# EAGLE design Display_Board_v4 (EAGLE 8.7.0)

## Sheet 1 of 3: Micro and CAN
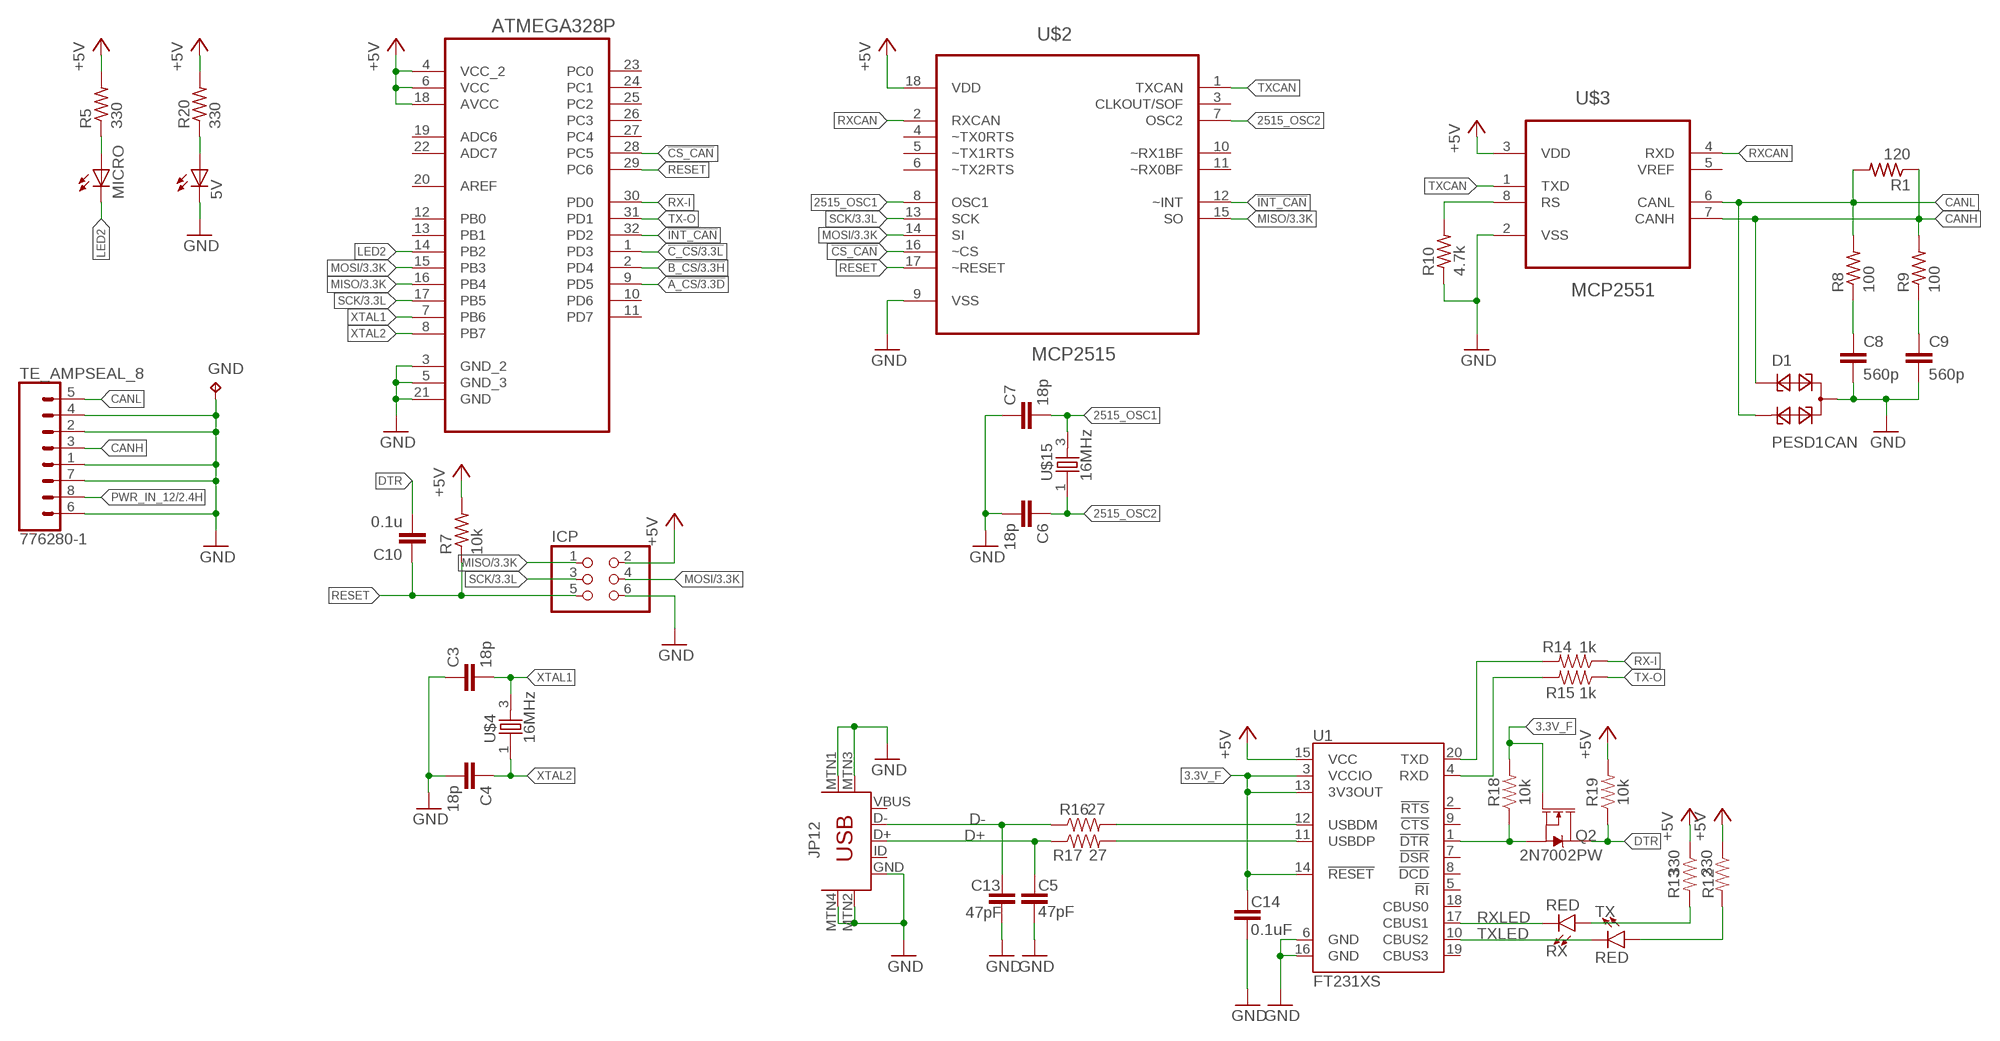
[diagram p0: schematic, sheet 1]

### Parts
5V  LEDCHIP-LED0805  [CHIP-LED0805]
ATMEGA328P  ATMEGA328P-AU  [QFP80P900X900X120-32N]
C3  18p  C-EUC0805K  [C0805K]
C4  18p  C-EUC0805K  [C0805K]
C5  47pF  47PF-0603-50V-5%  [0603]
C6  18p  C-EUC0805K  [C0805K]
C7  18p  C-EUC0805K  [C0805K]
C8  560p  C-EUC0805K  [C0805K]
C9  560p  C-EUC0805K  [C0805K]
C10  0.1u  C-EUC0805K  [C0805K]
C13  47pF  47PF-0603-50V-5%  [0603]
C14  0.1uF  0.1UF-0603-25V-(+80/-20%)  [0603]
D1  PESD1CAN  [SOT23]
GND  TPTP12SQ  [TP12SQ]
ICP  PINHD-2X3  [2X03]
JP12  USB-MINIB-5PIN  [USB-MINIB]
MICRO  LEDCHIP-LED0805  [CHIP-LED0805]
Q2  2N7002PW  MOSFET-NCH-2N7002PW  [SOT323]
R1  120  R-US_R0805  [R0805]
R5  330  R-US_R0805  [R0805]
R7  10k  R-US_R0805  [R0805]
R8  100  R-US_R0805  [R0805]
R9  100  R-US_R0805  [R0805]
R10  4.7k  R-US_R0805  [R0805]
R12  330  1KOHM-0603-1/10W-1%  [0603]
R13  330  1KOHM-0603-1/10W-1%  [0603]
R14  1k  1KOHM-0603-1/10W-1%  [0603]
R15  1k  1KOHM-0603-1/10W-1%  [0603]
R16  27  27OHM-0603-1/10W-1%  [0603]
R17  27  27OHM-0603-1/10W-1%  [0603]
R18  10k  10KOHM-0603-1/10W-1%  [0603]
R19  10k  10KOHM-0603-1/10W-1%  [0603]
R20  330  R-US_R0805  [R0805]
RX  RED  LED1206  [LED-1206]
TE_AMPSEAL_8  776280-1  [776280-1]
TX  RED  LED1206  [LED-1206]
U1  FT231XS  [SSOP20_L]
U$2  MCP2515  MCP2515-I/SO  [SOIC127P1034X264-18N]
U$3  MCP2551  MCP2551-I/SN  [SOIC127P600X175-8N]
U$4  16MHz  406CYRYSTAL  [CTS406]
U$15  16MHz  406CYRYSTAL  [CTS406]

### Nets
3.3V_F: C14.1 Q2.1(G) R18.2 U1.3(VCCIO) U1.13(3V3OUT) U1.14(!RESET)
2515_OSC1: C7.2 U$2.8(OSC1) U$15.3
2515_OSC2: C6.1 U$2.7(OSC2) U$15.1
!A_CS: ATMEGA328P.9(PD5) ; also sheet 3
!B_CS: ATMEGA328P.2(PD4) ; also sheet 3
!C_CS: ATMEGA328P.1(PD3) ; also sheet 3
!CS_CAN: ATMEGA328P.28(PC5) U$2.16(~CS)
!INT_CAN: ATMEGA328P.32(PD2) U$2.12(~INT)
+5V: ATMEGA328P.4(VCC_2) ATMEGA328P.6(VCC) ATMEGA328P.18(AVCC) ICP.2 R5.2 R7.2 R12.1 R13.1 R19.2 R20.2 U1.15(VCC) U$2.18(VDD) U$3.3(VDD) ; also sheet 2,3
CANH: D1.1 R1.1 R9.2 TE_AMPSEAL_8.3 U$3.7(CANH)
CANL: D1.2 R1.2 R8.2 TE_AMPSEAL_8.5 U$3.6(CANL)
D+: C5.1 JP12.D+ R17.1
D-: C13.1 JP12.D- R16.1
DTR: C10.2 Q2.3(D) R19.1
FTDI_DTR: Q2.2(S) R18.1 U1.1(!DTR)
GND: 5V.C ATMEGA328P.3(GND_2) ATMEGA328P.5(GND_3) ATMEGA328P.21(GND) C3.1 C4.2 C5.2 C6.2 C7.1 C8.2 C9.2 C13.2 C14.2 D1.3 GND.TP ICP.6 JP12.GND JP12.MTN1(MTN2) JP12.MTN2(MTN3) JP12.MTN3(MTN1) JP12.MTN4 R10.1 TE_AMPSEAL_8.1 TE_AMPSEAL_8.2 TE_AMPSEAL_8.4 TE_AMPSEAL_8.6 TE_AMPSEAL_8.7 U1.6(GND) U1.16(GND) U$2.9(VSS) U$3.2(VSS) ; also sheet 2,3
LED2: ATMEGA328P.14(PB2) MICRO.C
MISO: ATMEGA328P.16(PB4) ICP.1 U$2.15(SO) ; also sheet 3
MOSI: ATMEGA328P.15(PB3) ICP.4 U$2.14(SI) ; also sheet 3
N$1: R12.2 TX.A
N$2: R16.2 U1.12(USBDM)
N$3: MICRO.A R5.1
N$4: R17.2 U1.11(USBDP)
N$5: R10.2 U$3.8(RS)
N$6: C8.1 R8.1
N$7: C9.1 R9.1
N$10: R13.2 RX.A
N$12: 5V.A R20.1
PWR_IN_12: TE_AMPSEAL_8.8 ; also sheet 2
RESET: ATMEGA328P.29(PC6) C10.1 ICP.5 R7.1 U$2.17(~RESET)
RX-I: ATMEGA328P.30(PD0) R14.1
RXCAN: U$2.2(RXCAN) U$3.4(RXD)
RXD1: R15.2 U1.4(RXD)
RXLED: RX.C U1.17(CBUS1)
SCK: ATMEGA328P.17(PB5) ICP.3 U$2.13(SCK) ; also sheet 3
TX-O: ATMEGA328P.31(PD1) R15.1
TXCAN: U$2.1(TXCAN) U$3.1(TXD)
TXD1: R14.2 U1.20(TXD)
TXLED: TX.C U1.10(CBUS2)
XTAL1: ATMEGA328P.7(PB6) C3.2 U$4.3
XTAL2: ATMEGA328P.8(PB7) C4.1 U$4.1
Unconnected: ATMEGA328P.10(PD6) ATMEGA328P.11(PD7) ATMEGA328P.12(PB0) ATMEGA328P.13(PB1) ATMEGA328P.19(ADC6) ATMEGA328P.20(AREF) ATMEGA328P.22(ADC7) ATMEGA328P.23(PC0) ATMEGA328P.24(PC1) ATMEGA328P.25(PC2) ATMEGA328P.26(PC3) ATMEGA328P.27(PC4) JP12.ID JP12.VBUS U1.2(!RTS) U1.5(!RI) U1.7(!DSR) U1.8(!DCD) U1.9(!CTS) U1.18(CBUS0) U1.19(CBUS3) U$2.3(CLKOUT/SOF) U$2.4(~TX0RTS) U$2.5(~TX1RTS) U$2.6(~TX2RTS) U$2.10(~RX1BF) U$2.11(~RX0BF) U$3.5(VREF)

## Sheet 2 of 3: Power
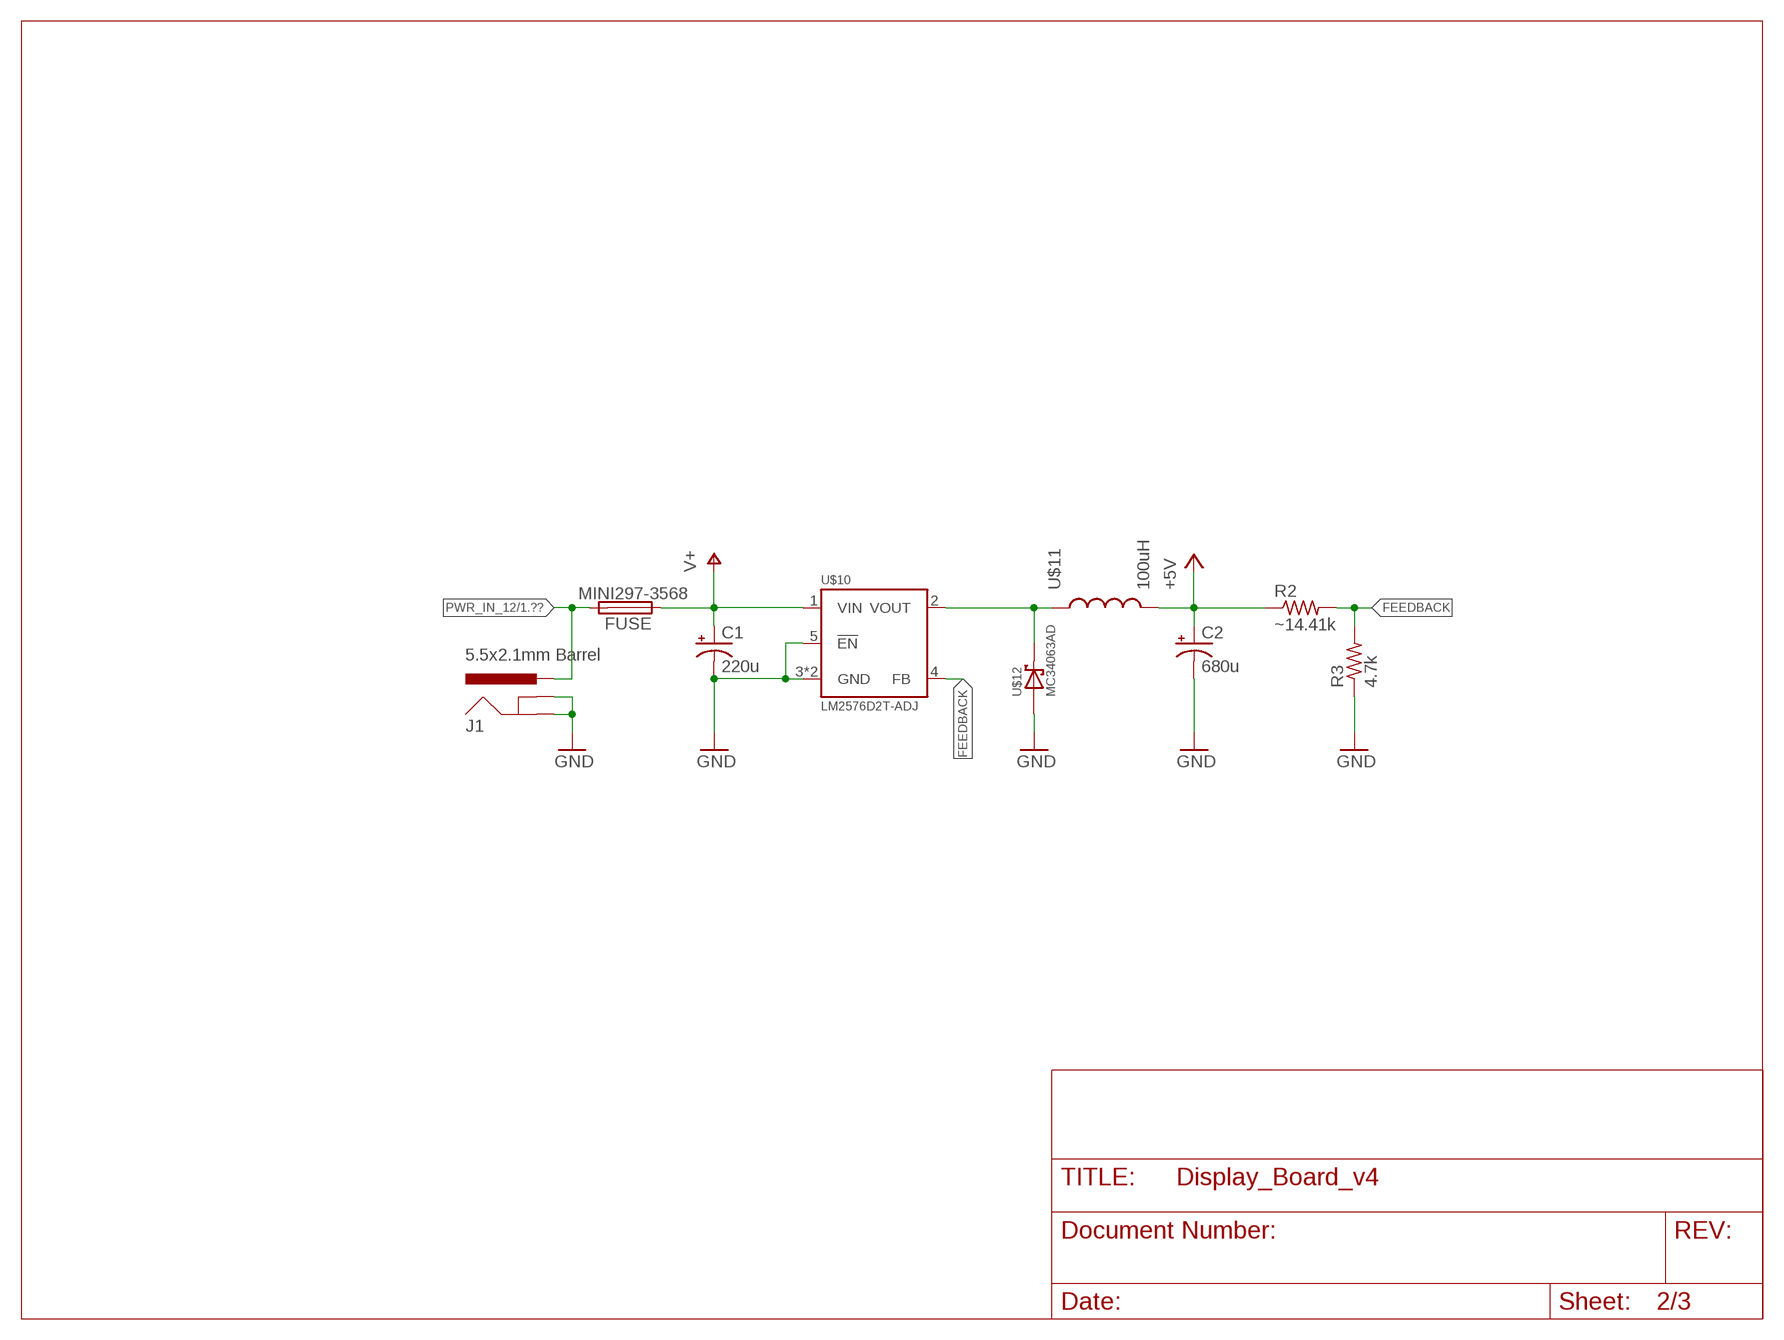
[diagram p1: schematic, sheet 2]

### Parts
C1  220u  CPOL-USUD-6,3X7,7  [UD-6,3X7,7_NICHICON]
C2  680u  CPOL-USUD-6,3X7,7  [UD-6,3X7,7_NICHICON]
FUSE  MINI297-3568  [3568]
J1  5.5x2.1mm Barrel  POWER_JACKSMD  [POWER_JACK_SMD]
R2  ~14.41k  R-US_R0603  [R0603]
R3  4.7k  R-US_R0603  [R0603]
U$10  LM2576D2T-ADJ  [TO263-5]
U$11  100uH  INDUCTOR  [12MM_12MM_INDUCTOR]
U$12  MC34063AD  [SMC]

### Nets
+5V: C2.+ R2.1 U$11.P$2 ; also sheet 1,3
FEEDBACK: R2.2 R3.2 U$10.4(FB)
GND: C1.- C2.- J1.GND(GNDBREAK) J1.P$4(GND) R3.1 U$10.3(GND) U$10.5(!EN) U$10.6(GND) U$12.A ; also sheet 1,3
N$8: U$10.2(VOUT) U$11.P$1 U$12.C
PWR_IN_12: FUSE.P$2 FUSE.P$3 J1.VIN0(PWR) ; also sheet 1
V+: C1.+ FUSE.P$1 FUSE.P$4 U$10.1(VIN)

## Sheet 3 of 3: Displays
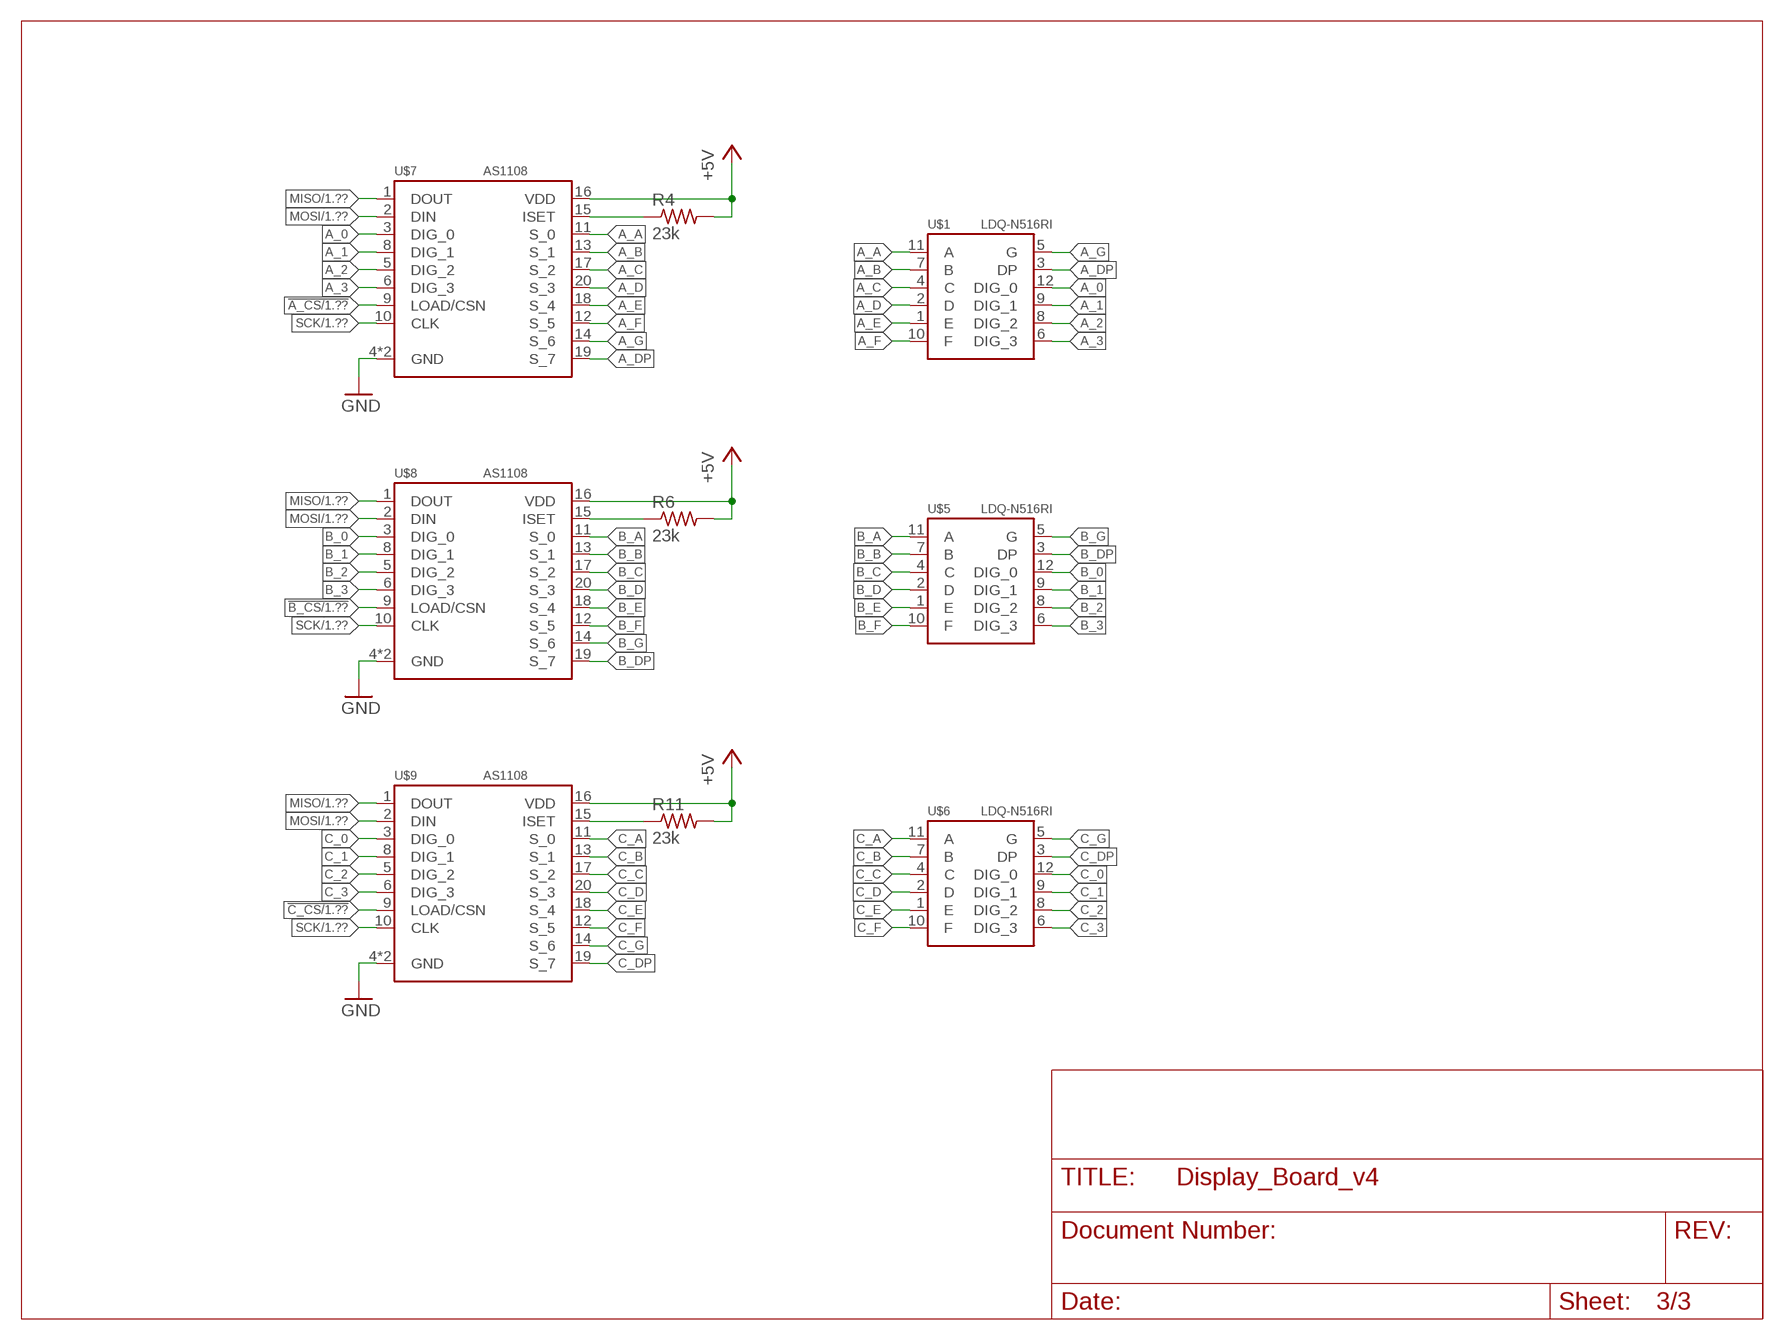
[diagram p2: schematic, sheet 3]

### Parts
R4  23k  R-US_R0603  [R0603]
R6  23k  R-US_R0603  [R0603]
R11  23k  R-US_R0603  [R0603]
U$1  LDQ-N516RI  [4_DIGIT_7_SEGMENT_DISPLAY_0.56"]
U$5  LDQ-N516RI  [4_DIGIT_7_SEGMENT_DISPLAY_0.56"]
U$6  LDQ-N516RI  [4_DIGIT_7_SEGMENT_DISPLAY_0.56"]
U$7  AS1108  [SO20L]
U$8  AS1108  [SO20L]
U$9  AS1108  [SO20L]

### Nets
!A_CS: U$7.9(LOAD/CSN) ; also sheet 1
!B_CS: U$8.9(LOAD/CSN) ; also sheet 1
!C_CS: U$9.9(LOAD/CSN) ; also sheet 1
+5V: R4.2 R6.2 R11.2 U$7.16(VDD) U$8.16(VDD) U$9.16(VDD) ; also sheet 1,2
A_0: U$1.12(DIG_0) U$7.3(DIG_0)
A_1: U$1.9(DIG_1) U$7.8(DIG_1)
A_2: U$1.8(DIG_2) U$7.5(DIG_2)
A_3: U$1.6(DIG_3) U$7.6(DIG_3)
A_A: U$1.11(A) U$7.11(S_0)
A_B: U$1.7(B) U$7.13(S_1)
A_C: U$1.4(C) U$7.17(S_2)
A_D: U$1.2(D) U$7.20(S_3)
A_DP: U$1.3(DP) U$7.19(S_7)
A_E: U$1.1(E) U$7.18(S_4)
A_F: U$1.10(F) U$7.12(S_5)
A_G: U$1.5(G) U$7.14(S_6)
B_0: U$5.12(DIG_0) U$8.3(DIG_0)
B_1: U$5.9(DIG_1) U$8.8(DIG_1)
B_2: U$5.8(DIG_2) U$8.5(DIG_2)
B_3: U$5.6(DIG_3) U$8.6(DIG_3)
B_A: U$5.11(A) U$8.11(S_0)
B_B: U$5.7(B) U$8.13(S_1)
B_C: U$5.4(C) U$8.17(S_2)
B_D: U$5.2(D) U$8.20(S_3)
B_DP: U$5.3(DP) U$8.19(S_7)
B_E: U$5.1(E) U$8.18(S_4)
B_F: U$5.10(F) U$8.12(S_5)
B_G: U$5.5(G) U$8.14(S_6)
C_0: U$6.12(DIG_0) U$9.3(DIG_0)
C_1: U$6.9(DIG_1) U$9.8(DIG_1)
C_2: U$6.8(DIG_2) U$9.5(DIG_2)
C_3: U$6.6(DIG_3) U$9.6(DIG_3)
C_A: U$6.11(A) U$9.11(S_0)
C_B: U$6.7(B) U$9.13(S_1)
C_C: U$6.4(C) U$9.17(S_2)
C_D: U$6.2(D) U$9.20(S_3)
C_DP: U$6.3(DP) U$9.19(S_7)
C_E: U$6.1(E) U$9.18(S_4)
C_F: U$6.10(F) U$9.12(S_5)
C_G: U$6.5(G) U$9.14(S_6)
GND: U$7.4(GND) U$7.7(GND) U$8.4(GND) U$8.7(GND) U$9.4(GND) U$9.7(GND) ; also sheet 1,2
MISO: U$7.1(DOUT) U$8.1(DOUT) U$9.1(DOUT) ; also sheet 1
MOSI: U$7.2(DIN) U$8.2(DIN) U$9.2(DIN) ; also sheet 1
N$15: R6.1 U$8.15(ISET)
N$19: R11.1 U$9.15(ISET)
N$22: R4.1 U$7.15(ISET)
SCK: U$7.10(CLK) U$8.10(CLK) U$9.10(CLK) ; also sheet 1

## Library data of the parts
5V MICRO = led:LED: LED OSRAM: - CHIPLED LG R971, LG N971, LY N971, LG Q971, LY Q971, LO R971, LY R971 LH N974, LH R974 LS Q976, LO Q976, LY Q976 LO Q996 - Hyper CHIPLED LW Q18S LB Q993, LB Q99A, LB R99A - SideLED LS A670, LO A670, LY A670, LG A670, LP A670 LB A673, LV A673, LT A673, LW A673 LH A674 LY A675 LS A676, LA A676, LO A676, LY A676, LW A676 LS A679, LY A679, LG A679 - Hyper Micro SIDELED® LS Y876, LA Y876, LO Y876, LY Y876 LT Y87S - SmartLED LW L88C, LW L88S LB L89C, LB L89S, LG L890 LS L89K, LO L89K, LY L89K LS L896, LA L896, LO L896, LY L896 - TOPLED LS T670, LO T670, LY T670, LG T670, LP T670 LSG T670, LSP T670, LSY T670, LOP T670, LYG T670 LG T671, LOG T671, LSG T671 LB T673, LV T673, LT T673, LW T673 LH T674 LS T676, LA T676, LO T676, LY T676, LB T676, LH T676, LSB T676, LW T676 LB T67C, LV T67C, LT T67C, LS T67K, LO T67K, LY T67K, LW E67C LS E67B, LA E67B, LO E67B, LY E67B, LB E67C, LV E67C, LT E67C LW T67C LS T679, LY T679, LG T679 LS T770, LO T770, LY T770, LG T770, LP T770 LB T773, LV T773, LT T773, LW T773 LH T774 LS E675, LA E675, LY E675, LS T675 LS T776, LA T776, LO T776, LY T776, LB T776 LHGB T686 LT T68C, LB T68C - Hyper Mini TOPLED® LB M676 - Mini TOPLED Santana® LG M470 LS M47K, LO M47K, LY M47K Source: http://www.osram.convergy.de LUXEON: - LUMILED® LXK2-PW12-R00, LXK2-PW12-S00, LXK2-PW14-U00, LXK2-PW14-V00 LXK2-PM12-R00, LXK2-PM12-S00, LXK2-PM14-U00 LXK2-PE12-Q00, LXK2-PE12-R00, LXK2-PE12-S00, LXK2-PE14-T00, LXK2-PE14-U00 LXK2-PB12-K00, LXK2-PB12-L00, LXK2-PB12-M00, LXK2-PB14-N00, LXK2-PB14-P00, LXK2-PB14-Q00 LXK2-PR12-L00, LXK2-PR12-M00, LXK2-PR14-Q00, LXK2-PR14-R00 LXK2-PD12-Q00, LXK2-PD12-R00, LXK2-PD12-S00 LXK2-PH12-R00, LXK2-PH12-S00 LXK2-PL12-P00, LXK2-PL12-Q00, LXK2-PL12-R00 Source: www.luxeon.com KINGBRIGHT: KA-3528ASYC Source: www.kingbright.com
ATMEGA328P = Atmel_By_element14_Batch_1-00:ATMEGA328P-AU: 8-bit Microcontroller with In-System Programmable Flash; MPN: ATMEGA328P-AU; OC_FARNELL: 1715486; OC_NEWARK: 14R4631; PACKAGE: TQFP-32; SUPPLIER: Atmel
C1 C2 = rcl:CPOL-US: POLARIZED CAPACITOR, American symbol; SPICEPREFIX: C
C3 C4 C6 C7 C10 = resistor:C-EU: CAPACITOR, European symbol
C5 C13 = SparkFun-Capacitors:47PF: 47pF ceramic capacitors A capacitor is a passive two-terminal electrical component used to store electrical energy temporarily in an electric field.; PROD_ID: CAP-08913
C8 C9 = rcl:C-EU: CAPACITOR, European symbol
C14 = SparkFun-Capacitors:0.1UF: 0.1µF ceramic capacitors A capacitor is a passive two-terminal electrical component used to store electrical energy temporarily in an electric field.; PROD_ID: CAP-00810
D1 = diode:PESD1CAN: CAN bus ESD protection diode Source: http://www.nxp.com/documents/data_sheet/PESD1CAN.pdf
FUSE = Fuse:MINI297-3568
GND = testpad:TP: Test pad
ICP = pinhead:PINHD-2X3: PIN HEADER
J1 = SparkFun-Connectors:POWER_JACK: Power Jack This is the standard 5.5mm barrel jack for power. The PTH is the most common, proven, reliable, footprint. The Slot footprint only works if the mill layer is transmitted to the PCB fab house so be warned. Mating wall wart : TOL-00298 (and others); PROD_ID: CONN-08106; SF_ID: PRT-12748
JP12 = SparkFun-Connectors:USB-MINIB: Mini-USB "B" connector with 5th pin broken out. Created new symbol breaking out 5th "ID" pin in mini/micro USB connector spec. See: http://en.wikipedia.org/wiki/Mini_usb#Cables. Uses same footprint as 4-pin symbol. Also added pins to connect to mounting / shield pads if required (probably not generally needed as signals aren't shielded once they leave the connector).; PROD_ID: CONN-08193
Q2 = SparkFun-DiscreteSemi:MOSFET-NCH: N-channel MOSFETs Voltage controlled devices that allow control of high current outputs.; PROD_ID: TRANS-11151; VALUE: 310mA/60V/1.6Ω
R1 R7-R10 = rcl:R-US_: RESISTOR, American symbol
R2-R4 R6 R11 = rcl:R-US_: RESISTOR, American symbol; SPICEPREFIX: R
R5 R20 = resistor:R-US_: RESISTOR, American symbol
R12 R13 = SparkFun-Resistors:1KOHM: 1kΩ resistor A resistor is a passive two-terminal electrical component that implements electrical resistance as a circuit element. Resistors act to reduce current flow, and, at the same time, act to lower voltage levels within circuits.; PROD_ID: RES-07856; VALUE: 1k
R14 R15 = SparkFun-Resistors:1KOHM: 1kΩ resistor A resistor is a passive two-terminal electrical component that implements electrical resistance as a circuit element. Resistors act to reduce current flow, and, at the same time, act to lower voltage levels within circuits.; PROD_ID: RES-07856
R16 R17 = SparkFun-Resistors:27OHM: 27Ω resistor A resistor is a passive two-terminal electrical component that implements electrical resistance as a circuit element. Resistors act to reduce current flow, and, at the same time, act to lower voltage levels within circuits.; PROD_ID: RES-09334
R18 R19 = SparkFun-Resistors:10KOHM: 10kΩ resistor A resistor is a passive two-terminal electrical component that implements electrical resistance as a circuit element. Resistors act to reduce current flow, and, at the same time, act to lower voltage levels within circuits.; PROD_ID: RES-00824
RX = SparkFun-LED:LED: LED (Generic) Standard schematic elements and footprints for 5mm, 3mm, 1206, and 0603 sized LEDs. Generic LEDs with no color specified.; PROD_ID: DIO-09909
TE_AMPSEAL_8 = IFE_AMPSEAL_Conn:776280-1: AMPSEAL 8pin Connector Ampseal 8-pin connector Model: 776280-1
TX = SparkFun-LED:LED: LED (Generic) Standard schematic elements and footprints for 5mm, 3mm, 1206, and 0603 sized LEDs. Generic LEDs with no color specified.; PROD_ID: DIO-09912
U1 = SparkFun-IC-Comms:FT231X: FTDI FT231X Full Speed USB to Full-handshake UART This USB2.0 Full Speed IC offers a compact bridge to full handshake UART interfaces. The device is a UART, capable of operating up to 3MBaud, with low power consumption (8mA). The FT231X includes the complete FT-X series feature set and enables USB to be added into a system design quickly and easily over a UART interface.; PROD_ID: IC-11524
U$1 U$5 U$6 = Display_Custom:LDQ-N516RI: https://www.lumex.com/content/files/ProductAttachment/LDQ-N516RI.pdf
U$2 = Microchip_By_element14_Batch_1:MCP2515-I/SO: CAN Controller; MPN: MCP2515-I/SO; OC_FARNELL: 1292239; OC_NEWARK: 29H7136; PACKAGE: SOIC-18; SUPPLIER: Microchip
U$3 = Microchip_By_element14_Batch_1:MCP2551-I/SN: High-Speed CAN Transceiver; MPN: MCP2551-I/SN; OC_FARNELL: 9758569; OC_NEWARK: 69K7604; PACKAGE: SOIC-8; SUPPLIER: Microchip
U$4 U$15 = Display_Custom:406CYRYSTAL: Crystal Oscillator in 406 SMT Package https://www.ctscorp.com/wp-content/uploads/406.pdf
U$7-U$9 = Display_Custom:AS1108: AS1108 http://ams.com/documents/20143/36005/AS1108_DS000169_2-00.pdf
U$10 = Display_Custom:LM2576D2T-ADJ: LM2576D2T-ADJ Adjustable Buck Voltage Regulator http://www.onsemi.com/pub/Collateral/LM2576-D.PDF
U$11 = Display_Custom:INDUCTOR
U$12 = Display_Custom:MC34063AD: MC34063AD https://www.fairchildsemi.com/datasheets/MB/MBRS320.pdf 3 watt, 3A, fV 500mV, 20v rV

## Net classes
0 default: width 0.152 mm, drill 0.305 mm, clearance 0.152 mm

## Board
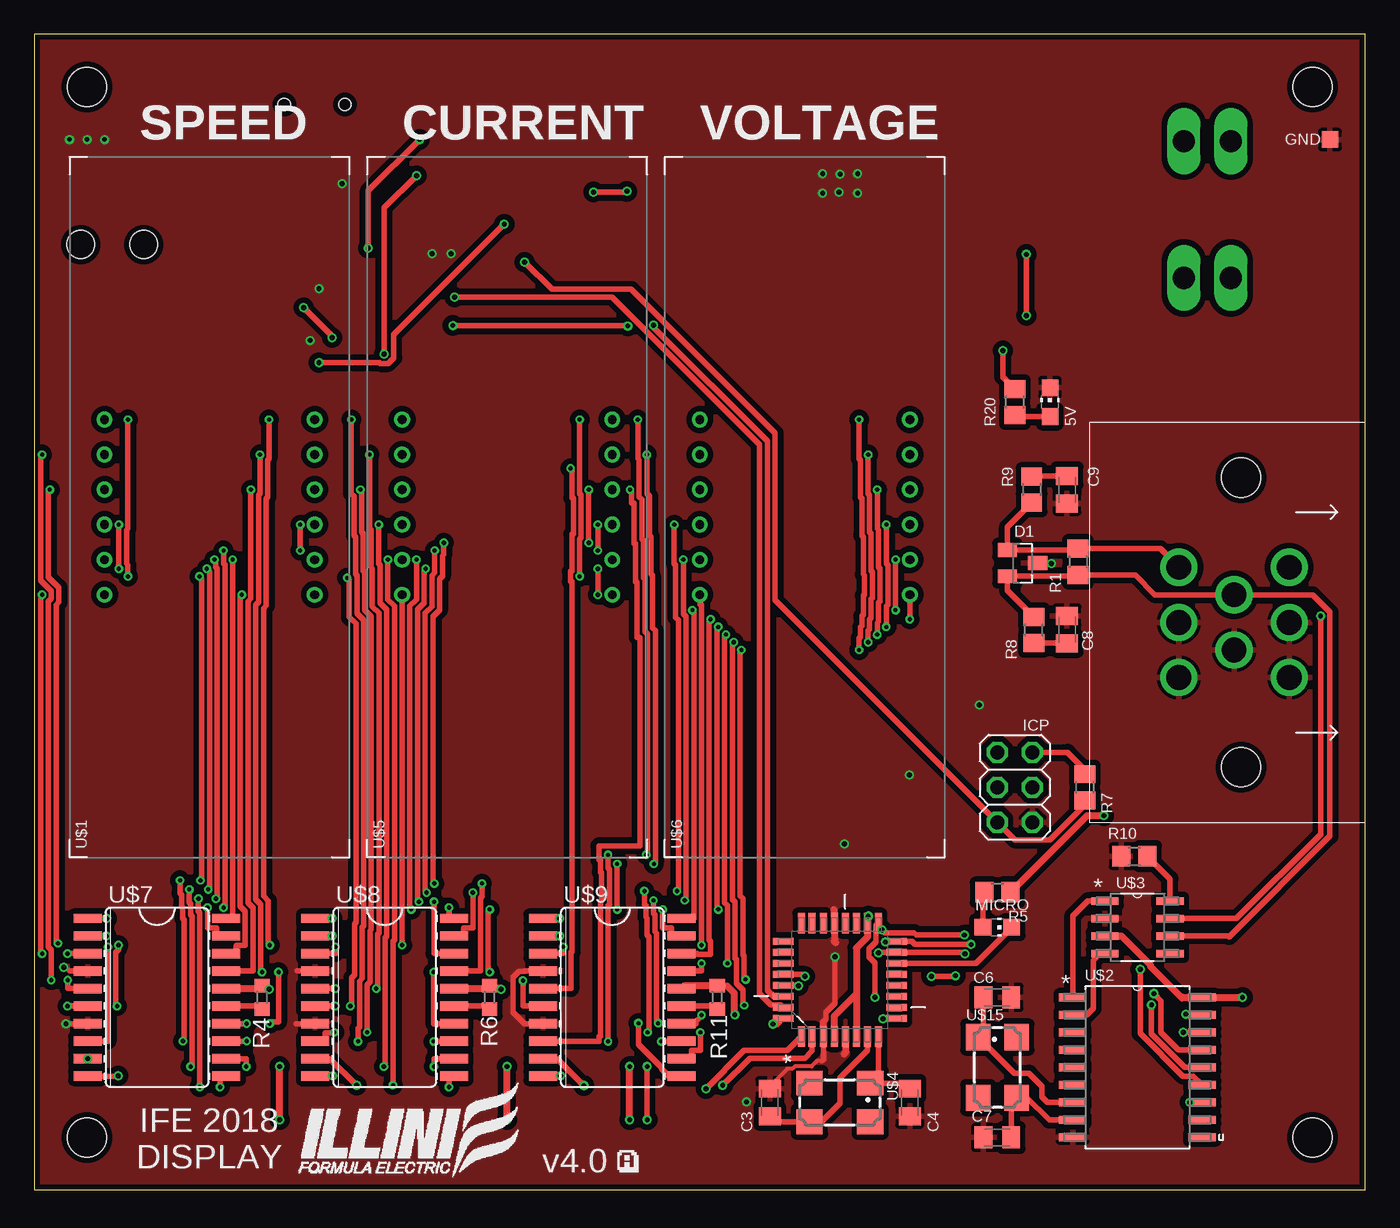
[diagram p3: board, top side]
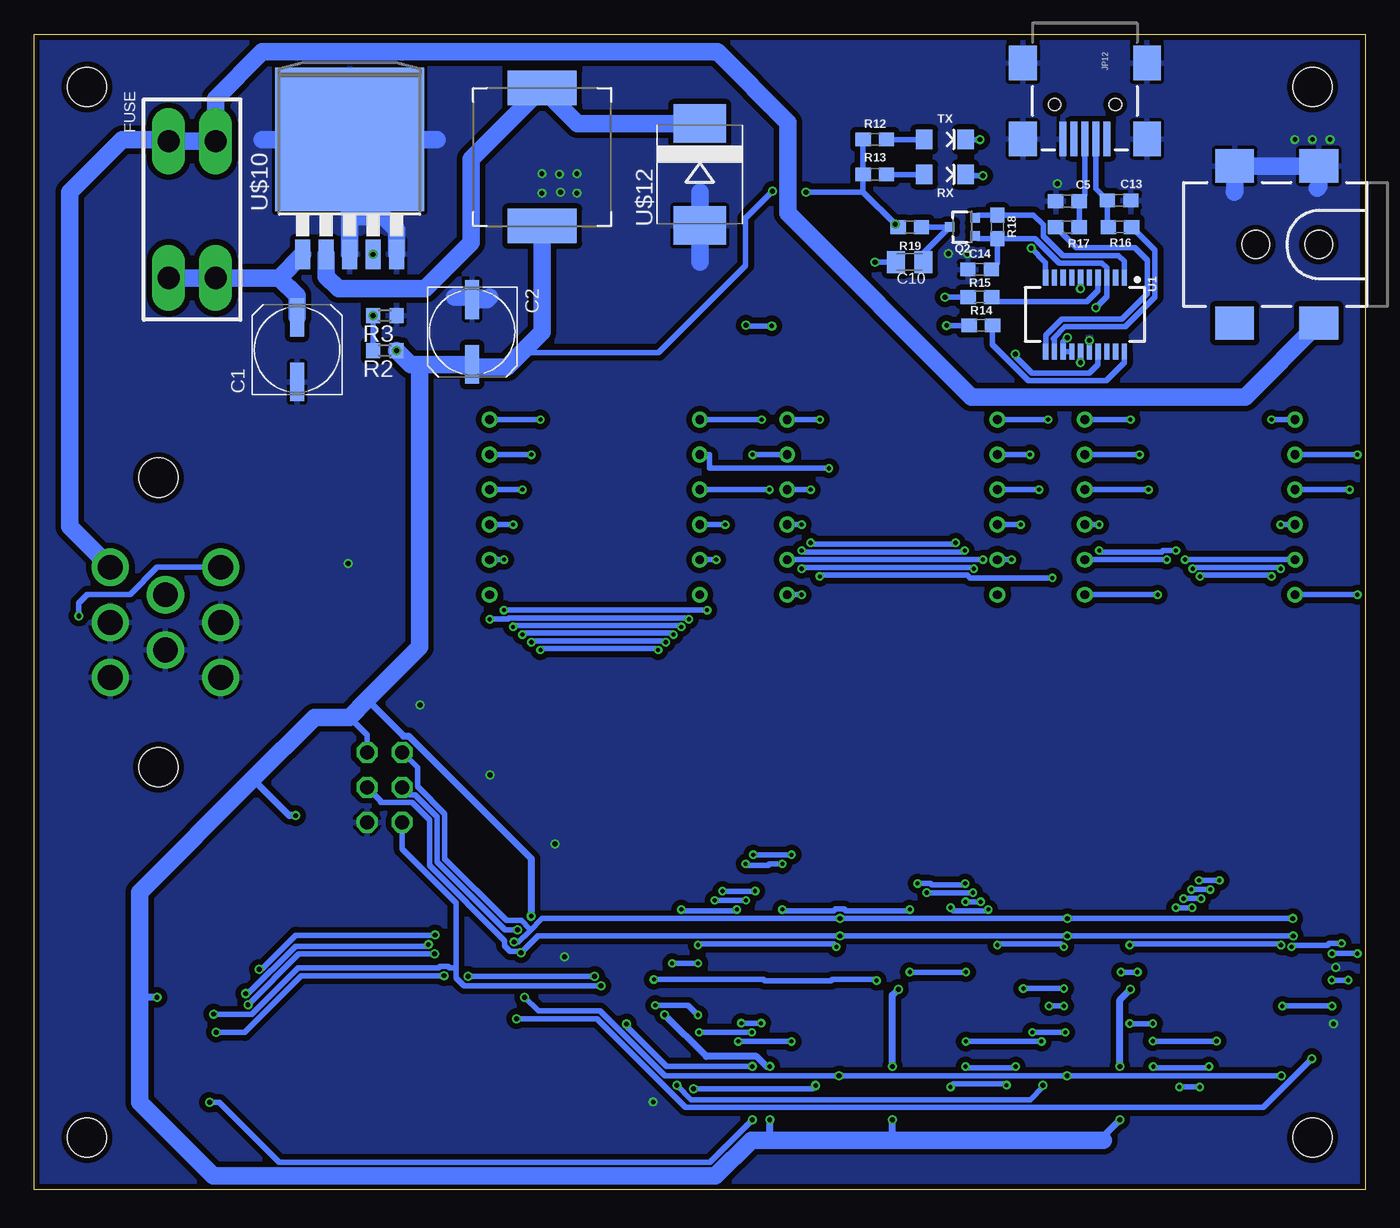
[diagram p4: board, bottom side, seen from below]

Size 96.52 x 83.82 mm. Coordinates in mm from the lower left corner, seen from the top.
Outline: 0,0 96.52,0 96.52,83.82 0,83.82 0,0
Copper layers (1*16): Top 0.035mm / dielectric 1.5mm / Bottom 0.035mm
Design rules "SeeedStudio_2layer_DRU_no_angle_20140221": minimum track width 6mil, minimum drill 12mil, track to track 6mil, track to pad 6mil, pad to pad 6mil, via to via 6mil, smd to smd 0mil, copper to edge 10mil, drill to drill 10mil, minimum pad ring 10mil, minimum via ring 6mil, stop-mask expansion 2mil, vias tented up to drill 100mil, thermal gap 10mil
Holes 2.84 mm at 3.81,3.81 92.71,3.81 92.71,80.01 3.81,80.01

### Footprints (pad centres in the part's own frame; a part is rotated, then mirrored left to right if it is on the bottom)
CHIP-LED0805 = smd 1.2 x 1.2: A 0,-1.05; C 0,1.05
QFP80P900X900X120-32N = smd 1.473 x 0.508: 1 -4.115,2.794; 2 -4.115,2.007; 3 -4.115,1.194; 4 -4.115,0.406; 5 -4.115,-0.406; 6 -4.115,-1.194; 7 -4.115,-2.007; 8 -4.115,-2.794; 17 4.115,-2.794; 18 4.115,-2.007; 19 4.115,-1.194; 20 4.115,-0.406; 21 4.115,0.406; 22 4.115,1.194; 23 4.115,2.007; 24 4.115,2.794 | smd 0.508 x 1.473: 9 -2.794,-4.115; 10 -2.007,-4.115; 11 -1.194,-4.115; 12 -0.406,-4.115; 13 0.406,-4.115; 14 1.194,-4.115; 15 2.007,-4.115; 16 2.794,-4.115; 25 2.794,4.115; 26 2.007,4.115; 27 1.194,4.115; 28 0.406,4.115; 29 -0.406,4.115; 30 -1.194,4.115; 31 -2.007,4.115; 32 -2.794,4.115
UD-6,3X7,7_NICHICON = smd 2.8 x 1: + 2.35,0; - -2.35,0
C0805K = smd 1.3 x 1.6: 1 -1,0; 2 1,0
0603 = smd 1.1 x 1: 1 -0.85,0; 2 0.85,0
SOT23 = smd 1 x 1.4: 1 -0.95,-1.1; 2 0.95,-1.1; 3 0,1.1
3568 = drill 1.6 long: P$1 -4.96,1.7; P$2 4.96,1.7; P$3 4.96,-1.7; P$4 -4.96,-1.7
TP12SQ = smd 1.2 x 1.2: TP 0,0
2X03 = drill 1.016 octagon: 1 -2.54,-1.27; 2 -2.54,1.27; 3 0,-1.27; 4 0,1.27; 5 2.54,-1.27; 6 2.54,1.27
POWER_JACK_SMD = smd 2.8 x 2.4: GND 0,-5.7; P$4 6.1,-5.7; VIN0 0,5.7; VIN1 6.1,5.7 | hole 2.032: 0,0; 4.572,0
USB-MINIB = smd 2.5 x 0.5: D+ 2.5,0; D- 2.5,0.8; GND 2.5,-1.6; ID 2.5,-0.8; VBUS 2.5,1.6 | smd 2.5 x 2: MTN1 -3,4.5; MTN2 2.5,4.5; MTN3 -3,-4.5; MTN4 2.5,-4.5 | hole 0.9: 0,2.2; 0,-2.2
SOT323 = smd 0.7 x 0.7: 1 -0.65,-0.925; 2 0.65,-0.925; 3 0,0.925
R0805 = smd 1.3 x 1.5: 1 -0.95,0; 2 0.95,0
R0603 = smd 1 x 1.1: 1 -0.85,0; 2 0.85,0
LED-1206 = smd 1.2 x 1.4: A -1.5,0; C 1.5,0
776280-1 = drill 1.8: 1 10.5,13.5; 2 14.5,13.5; 3 18.5,13.5; 4 12.5,9.5; 5 16.5,9.5; 6 10.5,5.5; 7 14.5,5.5; 8 18.5,5.5 | hole 2.85: 4,9; 25,9
SSOP20_L = smd 0.381 x 1.143: 1 -2.857,-2.68; 2 -2.223,-2.68; 3 -1.587,-2.68; 4 -0.953,-2.68; 5 -0.318,-2.68; 6 0.318,-2.68; 7 0.953,-2.68; 8 1.587,-2.68; 9 2.223,-2.68; 10 2.857,-2.68; 11 2.857,2.68; 12 2.223,2.68; 13 1.587,2.68; 14 0.953,2.68; 15 0.318,2.68; 16 -0.318,2.68; 17 -0.953,2.68; 18 -1.587,2.68; 19 -2.223,2.68; 20 -2.857,2.68
4_DIGIT_7_SEGMENT_DISPLAY_0.56" = drill 0.635: 1 -6.35,-7.62; 2 -3.81,-7.62; 3 -1.27,-7.62; 4 1.27,-7.62; 5 3.81,-7.62; 6 6.35,-7.62; 7 6.35,7.62; 8 3.81,7.62; 9 1.27,7.62; 10 -1.27,7.62; 11 -3.81,7.62; 12 -6.35,7.62
SOIC127P1034X264-18N = smd 1.981 x 0.559: 1 -4.699,5.08; 2 -4.699,3.81; 3 -4.699,2.54; 4 -4.699,1.27; 5 -4.699,0; 6 -4.699,-1.27; 7 -4.699,-2.54; 8 -4.699,-3.81; 9 -4.699,-5.08; 10 4.699,-5.08; 11 4.699,-3.81; 12 4.699,-2.54; 13 4.699,-1.27; 14 4.699,0; 15 4.699,1.27; 16 4.699,2.54; 17 4.699,3.81; 18 4.699,5.08
SOIC127P600X175-8N = smd 1.981 x 0.559: 1 -2.362,1.905; 2 -2.362,0.635; 3 -2.362,-0.635; 4 -2.362,-1.905; 5 2.362,-1.905; 6 2.362,-0.635; 7 2.362,0.635; 8 2.362,1.905
CTS406 = smd 1.9 x 1.8: 1 -2.2,-1.4; 2 2.2,-1.4; 3 2.2,1.4; 4 -2.2,1.4
SO20L = smd 0.66 x 2.032: 1 -5.715,-5.029; 2 -4.445,-5.029; 3 -3.175,-5.029; 4 -1.905,-5.029; 5 -0.635,-5.029; 6 0.635,-5.029; 7 1.905,-5.029; 8 3.175,-5.029; 9 4.445,-5.029; 10 5.715,-5.029; 11 5.715,5.029; 12 4.445,5.029; 13 3.175,5.029; 14 1.905,5.029; 15 0.635,5.029; 16 -0.635,5.029; 17 -1.905,5.029; 18 -3.175,5.029; 19 -4.445,5.029; 20 -5.715,5.029
TO263-5 = smd 1.067 x 2.159: 1 -3.404,-5.791; 2 -1.702,-5.791; 3 0,-5.791; 4 1.702,-5.791; 5 3.404,-5.791 | smd 10.8 x 10.41: 6 0,2.54
12MM_12MM_INDUCTOR = smd 2.5 x 5: P$1 -5,0; P$2 5,0
SMC = smd 2.8 x 3.8: A 3.7,0; C -3.7,0

### Placement (x,y rotation side)
5V  73.66,57.15 0 top
ATMEGA328P  58.42,15.24 90 top
C1  77.47,60.96 90 bottom
C2  64.77,62.23 270 bottom
C3  53.34,6.35 270 top
C4  63.5,6.35 270 top
C5  21.59,71.73 180 bottom
C6  69.85,13.97 0 top
C7  69.85,3.81 0 top
C8  74.9,40.64 90 top
C9  74.9,50.8 270 top
C10  33.02,67.31 0 bottom
C13  17.83,71.78 0 bottom
C14  27.97,66.78 180 bottom
D1  71.68,45.47 270 top
FUSE  85.09,71.12 90 bottom
GND  93.98,76.2 0 top
ICP  71.12,29.21 270 top
J1  3.35,68.58 180 bottom
JP12  20.32,78.74 270 bottom
MICRO  69.85,19.05 270 top
Q2  29.21,69.85 90 bottom
R1  75.69,45.57 270 top
R2  71.09,60.88 180 bottom
R3  71.09,63.42 180 bottom
R4  16.51,13.97 90 top
R5  69.85,21.59 0 top
R6  33.02,13.97 90 top
R7  76.2,29.21 90 top
R8  72.49,40.61 90 top
R9  72.34,50.8 270 top
R10  79.78,24.21 0 top
R11  49.53,13.97 90 top
R12  35.56,76.2 0 bottom
R13  35.56,73.66 0 bottom
R14  27.86,62.71 0 bottom
R15  27.94,64.77 0 bottom
R16  17.78,69.85 0 bottom
R17  21.59,69.85 180 bottom
R18  26.67,69.85 270 bottom
R19  33.02,69.85 180 bottom
R20  71.12,57.15 90 top
RX  30.48,73.66 0 bottom
TE_AMPSEAL_8  96.52,26.67 90 top
TX  30.48,76.2 0 bottom
U1  20.32,63.5 180 bottom
U$1  12.7,49.53 90 top
U$2  80.01,8.89 0 top
U$3  80.01,19.05 0 top
U$4  58.42,6.35 180 top
U$5  34.29,49.53 90 top
U$6  55.88,49.53 90 top
U$7  8.89,13.97 270 top
U$8  25.4,13.97 270 top
U$9  41.91,13.97 270 top
U$10  73.66,73.66 0 bottom
U$11  59.69,74.93 270 bottom
U$12  48.26,73.66 270 bottom
U$15  69.85,8.89 270 top

### Tracks (layer width: path | path; a pad name or v marks a point on that pad's centre or on a via)
3.3V_F  (via drill 0.35)
  Top 0.406: v19.53,64.01 21.59,61.95 v21.59,61.82
  Bottom 0.406: U1.14 U1.13 21.91,61.51 v21.59,61.82 | R18.2 28.09,69 Q2.1 | R18.2 26.67,67.22 C14.1 | R18.2 23.93,69 22.17,67.23 19.07,67.23 18.73,66.89 U1.3 18.73,64.81 v19.53,64.01
2515_OSC1
  Top 0.406: C7.2 70.85,6.29 U$15.3 72,6.69 73.61,5.08 U$2.8
2515_OSC2
  Top 0.406: C6.1 68.85,11.49 U$15.1 71.08,8.46 72.14,8.46 73.08,7.52 73.08,6.76 73.48,6.35 U$2.7
!A_CS  (via drill 0.35)
  Top 0.406: ATMEGA328P.9 61.57,12.45 v61.54,12.42
  Bottom 0.406: v61.54,12.42 55.73,12.42 49.3,5.99 7.39,5.99 U$7.9
  other vias: 3.86,9.53
!B_CS  (via drill 0.35)
  Top 0.406: ATMEGA328P.2 56.41,10.08 55.88,9.55 51.89,9.55 v49.93,7.58 | v23.37,7.58 21.43,9.53 U$8.9
  Bottom 0.406: v49.93,7.58 48.89,6.55 24.28,6.55 23.37,7.47 v23.37,7.58
!C_CS  (via drill 0.35)
  Top 0.406: ATMEGA328P.1 54.61,10.11 51.48,10.11 v48.7,7.33 | v39.85,7.57 37.9,9.53 U$9.9
  Bottom 0.406: v48.7,7.33 40.09,7.33 v39.85,7.57
!CS_CAN  (via drill 0.35)
  Top 0.406: ATMEGA328P.28 55.73,15.65 v55.88,15.49 | v65.07,15.49 66.75,15.49 v66.8,15.54 | v83.34,11.43 U$2.16
  Bottom 0.406: v55.88,15.49 v65.07,15.49 | v66.8,15.54 77.17,15.54 81.28,11.43 v83.34,11.43
!INT_CAN  (via drill 0.35)
  Top 0.406: U$2.12 v83.82,6.35 | v44.45,5.08 v44.45,8.95 | v53.58,12.03 53.89,12.03 ATMEGA328P.32
  Bottom 0.406: v83.82,6.35 83.11,6.35 78.77,2.01 47.52,2.01 v44.45,5.08 | v44.45,8.95 50.68,8.95 53.58,11.85 v53.58,12.03
+5V  (via drill 0.35)
  Top 0.406: 32.8,14.61 R6.2 | 16.3,14.61 16.41,14.72 R4.2 | R20.2 70.25,58.98 R2.1 | ICP.2 74.93,31.75 76.2,30.48 R7.2 | v34.08,70.06 26.06,62.04 26.06,60.35 25.66,59.95 25.09,59.95 25.02,60.02 v20.64,60.02 | v40.56,72.39 42.92,72.39 v42.97,72.44
  Top 0.508: U$8.16 32.8,14.61 33.81,14.61 v33.86,14.55 | U$7.16 16.3,14.61 | U$3.3 78.84,18.41 80.95,16.31 80.95,16.2 83.24,13.92 83.29,13.97 U$2.18 v87.63,13.97 | R5.2 76.36,27.15 v77.57,27.15 | 59.61,14.22 59.61,17.55 60.43,18.36 ATMEGA328P.18 60.43,19.81 v60.48,19.86 | 59.61,14.22 ATMEGA328P.6 | ATMEGA328P.4 58.01,12.62 59.61,14.22 | v43.18,5.08 v43.18,8.95 | v50.8,12.7 50.77,12.72 50.77,14.28 50.27,14.78 49.57,14.78 R11.2 47.15,14.82 U$9.16 | v34.29,5.08 v34.29,8.95 | v17.78,5.08 v17.78,8.95 | v17.02,14.55 16.59,14.55 16.41,14.72
  Bottom 0.406: ICP.2 72.39,33.02 73.66,34.29 | U1.15 v20.64,60.02 | R12.1 R13.1 36.41,72.39 | R19.2 v34.08,70.06 36.41,72.39 | 36.41,72.39 v40.56,72.39 | v42.97,72.44 44.93,70.48 44.93,67.06 51.24,60.74 61.18,60.74
  Bottom 0.508: v87.63,13.97 88.9,13.97 | v77.57,27.15 78.03,27.15 80.68,29.81 | 72.39,35.56 69.75,32.92 69.37,32.92 60.48,24.03 v60.48,19.86 | 43.18,3.61 v43.18,5.08 | v43.18,8.95 43.41,8.95 44.15,9.69 47.78,9.69 v50.8,12.7 | 34.29,3.61 v34.29,5.08 | v34.29,8.95 34.29,14.12 v33.86,14.55 | 18.97,3.61 18.97,3.89 v17.78,5.08 | v17.78,8.95 17.78,13.79 v17.02,14.55
  Bottom 1.27: U$11.P$2 59.69,62.23 61.18,60.74 62.23,59.69 64.58,59.69 C2.+ 68.58,59.88 | 68.58,59.88 69.24,59.88 R2.1 | 68.58,59.88 68.58,39.37 72.39,35.56 73.66,34.29 76.2,34.29 80.68,29.81 88.9,21.59 88.9,13.97 88.9,6.35 83.57,1.02 47.11,1.02 44.52,3.61 43.18,3.61 34.29,3.61 18.97,3.61
  other vias: 70.24,60.88
A_0  (via drill 0.3)
  Top 0.406: v2.39,17.14 U$7.3 | v0.56,17.14 0.46,17.25 0.46,43.08 v0.56,43.18
  Bottom 0.406: v0.56,17.14 v2.39,17.14 | U$1.12 v0.56,43.18
A_1  (via drill 0.3)
  Top 0.406: U$7.8 5.33,10.79 v5.33,17.63 | v1.7,17.88 1.57,17.88 1.57,42.44 1.78,42.65 1.78,43.71 1.02,44.48 1.02,50.7 v1.12,50.8
  Bottom 0.406: v5.33,17.63 5.23,17.73 2.74,17.73 2.59,17.88 v1.7,17.88 | U$1.9 v1.12,50.8
A_2  (via drill 0.3)
  Top 0.406: U$7.5 2.41,14.61 v2.41,15.21 | v1.22,15.21 1.22,17.42 1.02,17.63 1.02,42.7 1.22,42.9 1.22,43.46 0.46,44.22 0.46,53.24 v0.56,53.34
  Bottom 0.406: v1.22,15.21 v2.41,15.21 | U$1.8 v0.56,53.34
A_3  (via drill 0.3)
  Top 0.406: v2.39,13.34 U$7.6 | v5.99,13.34 5.89,13.44 5.89,17.25 6.1,17.45 v6.1,17.75 | v17.07,17.75 16.97,17.86 16.97,20.98 16.61,21.34 16.61,42.19 16.82,42.39 16.82,50.16 16.92,50.27 16.92,52.96 17.02,53.06 v17.02,55.88
  Bottom 0.406: v5.99,13.34 v2.39,13.34 | v6.1,17.75 6.2,17.86 16.97,17.86 v17.07,17.75 | U$1.6 v17.02,55.88
A_A  (via drill 0.3)
  Top 0.406: U$7.11 13.46,8.26 v13.46,7.47 | v11.99,7.47 11.99,20.09 11.89,20.19 v11.89,21.13 | v13.16,21.13 13.26,21.23 13.26,45.09 13.16,45.19 13.16,45.62 v13.06,45.72
  Bottom 0.406: v11.99,7.47 v13.46,7.47 | v13.16,21.13 v11.89,21.13 | U$1.11 v13.06,45.72
A_B  (via drill 0.3)
  Top 0.406: v15.39,10.79 U$7.13 | v10.77,10.79 10.87,10.9 10.87,19.58 10.77,19.68 10.77,20.5 10.67,20.6 10.67,21.41 10.57,21.51 v10.57,22.45 | v12.04,22.45 12.14,22.55 12.14,44.32 v11.96,44.5 | v6.78,44.5 6.78,45.34 6.68,45.44 6.68,47.88 6.78,47.98 v6.78,55.88
  Bottom 0.406: v10.77,10.79 v15.39,10.79 | v12.04,22.45 v10.57,22.45 | v11.96,44.5 11.86,44.6 6.88,44.6 v6.78,44.5 | U$1.7 v6.78,55.88
A_C  (via drill 0.3)
  Top 0.406: U$7.17 15.85,15.88 15.85,20.47 15.49,20.83 15.49,42.7 15.7,42.9 v15.7,50.8
  Bottom 0.406: U$1.4 v15.7,50.8
A_D  (via drill 0.3)
  Top 0.406: U$7.20 14.38,19.68 v14.38,45.72
  Bottom 0.406: U$1.2 v14.38,45.72
A_DP  (via drill 0.3)
  Top 0.406: U$7.19 13.21,18.41 13.21,18.97 13.18,19 12.55,19 v12.55,20.47 | v13.72,20.47 13.82,20.57 13.82,45.34 13.72,45.44 v13.72,46.38 | v19.28,48.26 v19.28,46.38
  Bottom 0.406: v13.72,20.47 v12.55,20.47 | v13.72,46.38 14.66,46.38 14.76,46.28 19.18,46.28 v19.28,46.38 | U$1.3 v19.28,48.26
A_E  (via drill 0.3)
  Top 0.406: U$7.18 14.63,17.14 14.63,17.7 14.66,17.73 15.29,17.73 15.29,20.22 14.94,20.57 14.94,43.08 v15.04,43.18
  Bottom 0.406: U$1.1 v15.04,43.18
A_F  (via drill 0.3)
  Top 0.406: U$7.12 15.37,9.53 v15.37,8.94 | v11.33,8.94 11.43,9.04 11.43,19.84 11.33,19.94 11.33,20.75 11.23,20.85 v11.23,21.79 | v12.6,21.79 12.7,21.89 12.7,44.83 12.5,45.03 v12.5,45.06 | v6.12,48.26 v6.12,45.06
  Bottom 0.406: v15.37,8.94 15.27,8.84 11.43,8.84 v11.33,8.94 | v12.6,21.79 v11.23,21.79 | v12.5,45.06 12.39,45.16 6.22,45.16 v6.12,45.06 | U$1.10 v6.12,48.26
A_G  (via drill 0.3)
  Top 0.406: v15.39,12.06 U$7.14 | v17.07,12.06 17.2,12.19 17.7,12.19 v17.7,15.8 | v16.51,15.8 16.41,15.9 16.41,20.73 16.05,21.08 16.05,42.44 16.26,42.65 16.26,50.42 16.36,50.52 v16.36,53.34
  Bottom 0.406: v17.07,12.06 v15.39,12.06 | v16.51,15.8 v17.7,15.8 | U$1.5 v16.36,53.34
B_0  (via drill 0.3)
  Top 0.406: U$8.3 21.84,17.14 v21.84,17.63 | U$5.12 v26.67,17.75
  Bottom 0.406: v21.84,17.63 22.07,17.86 26.57,17.86 v26.67,17.75
B_1  (via drill 0.3)
  Top 0.406: U$8.8 21.08,10.79 21.08,11.35 21.11,11.38 21.74,11.38 v21.74,11.43 | v24.13,11.43 24.13,14.88 24.33,15.09 24.33,18.8 24.43,18.9 24.43,41.58 23.95,42.06 23.95,44.83 23.85,44.93 23.85,47.62 23.75,47.73 23.75,50.7 v23.65,50.8
  Bottom 0.406: v24.13,11.43 v21.74,11.43 | U$5.9 v23.65,50.8
B_2  (via drill 0.3)
  Top 0.406: v21.84,14.61 U$8.5 | v24.79,14.61 24.89,14.71 24.89,18.54 24.99,18.64 24.99,41.83 24.51,42.32 24.51,45.09 24.41,45.19 24.41,47.88 24.31,47.98 v24.31,53.34
  Bottom 0.406: v24.79,14.61 v21.84,14.61 | U$5.8 v24.31,53.34
B_3  (via drill 0.3)
  Top 0.406: v21.84,13.34 U$8.6 | v22.91,13.34 23.01,13.44 23.01,15.39 23.22,15.6 23.22,19.3 23.32,19.41 23.32,41.07 22.84,41.55 22.84,44.25 v22.68,44.4 | v39.55,44.5 39.55,47.22 39.65,47.32 39.65,50.42 39.55,50.52 v39.55,55.88
  Bottom 0.406: v22.91,13.34 v21.84,13.34 | v22.68,44.4 28.65,44.4 28.85,44.6 39.45,44.6 v39.55,44.5 | U$5.6 v39.55,55.88
B_A  (via drill 0.3)
  Top 0.406: U$8.11 30.07,8.26 v30.07,7.47 | v26.01,7.59 26.01,18.03 26.11,18.14 26.11,42.34 25.63,42.82 v25.63,45.72
  Bottom 0.406: v30.07,7.47 29.84,7.7 26.11,7.7 v26.01,7.59 | U$5.11 v25.63,45.72
B_B  (via drill 0.3)
  Top 0.406: U$8.13 28.96,10.79 v28.96,10.77 | v23.47,10.77 23.47,11.71 23.57,11.81 23.57,15.14 23.77,15.34 23.77,19.05 23.88,19.15 23.88,41.33 23.39,41.81 23.39,44.58 23.29,44.68 23.29,47.37 23.19,47.47 23.19,50.32 22.99,50.52 v22.99,55.88
  Bottom 0.406: v23.47,10.77 v28.96,10.77 | U$5.7 v22.99,55.88
B_C  (via drill 0.3)
  Top 0.406: U$8.17 32.36,15.88 32.36,21.18 32.46,21.29 v32.46,22.23 | v29.01,22.23 28.91,22.33 28.91,41.58 29.39,42.06 29.39,44.32 29.59,44.53 29.59,46 29.69,46.1 v29.69,46.94 | v40.21,50.8 v40.21,46.94
  Bottom 0.406: v32.46,22.23 31.52,22.23 31.42,22.12 29.11,22.12 v29.01,22.23 | v29.69,46.94 29.79,46.84 40.11,46.84 v40.21,46.94 | U$5.4 v40.21,50.8
B_D  (via drill 0.3)
  Top 0.406: U$8.20 30.07,19.68 v30.07,20.47 | v27.33,20.34 27.23,20.45 27.23,42.34 27.71,42.82 v27.71,45.72
  Bottom 0.406: v30.07,20.47 29.84,20.24 27.43,20.24 v27.33,20.34 | U$5.2 v27.71,45.72
B_DP  (via drill 0.3)
  Top 0.406: U$8.19 31.14,18.41 31.14,18.97 31.17,19 31.8,19 v31.8,21.57 | v28.45,21.57 28.35,21.67 28.35,41.83 28.83,42.32 28.83,44.58 29.03,44.78 v29.03,46.38 | v40.87,48.26 v40.87,46.38
  Bottom 0.406: v28.45,21.57 v31.8,21.57 | v29.03,46.38 29.13,46.28 40.77,46.28 v40.87,46.38 | U$5.3 v40.87,48.26
B_E  (via drill 0.3)
  Top 0.406: U$8.18 28.98,17.14 v28.98,20.9 | v27.89,20.9 27.79,21.01 27.79,42.09 28.27,42.57 28.27,44.96 v28.37,45.06 | v40.87,43.18 v40.87,45.06
  Bottom 0.406: v27.89,20.9 v28.98,20.9 | v28.37,45.06 28.47,45.16 40.77,45.16 v40.87,45.06 | U$5.1 v40.87,43.18
B_F  (via drill 0.3)
  Top 0.406: U$8.12 28.98,9.53 v28.98,8.94 | v25.35,8.94 25.45,9.04 25.45,18.29 25.55,18.39 25.55,42.09 25.07,42.57 25.07,45.34 24.97,45.44 v24.97,48.26
  Bottom 0.406: v28.98,8.94 28.88,8.84 25.45,8.84 v25.35,8.94 | U$5.10 v24.97,48.26
B_G  (via drill 0.3)
  Top 0.406: U$8.14 28.96,12.06 v28.96,15.8 | v33.02,15.8 32.92,15.9 32.92,20.24 v33.02,20.34 | v42.27,23.65 v42.27,20.34 | v44.93,23.65 45.03,23.75 45.03,40.56 44.83,40.77 44.83,44.58 44.73,44.68 44.73,47.37 44.63,47.47 44.63,50.32 44.42,50.52 v44.42,53.34
  Bottom 0.406: v33.02,15.8 v28.96,15.8 | v33.02,20.34 33.12,20.24 37.67,20.24 37.8,20.37 38.41,20.37 38.53,20.24 42.16,20.24 v42.27,20.34 | v42.27,23.65 43.2,23.65 43.31,23.55 44.83,23.55 v44.93,23.65 | U$5.5 v44.42,53.34
C_0  (via drill 0.3)
  Top 0.406: U$9.3 38.35,17.14 v38.35,17.63 | v48.39,17.75 48.39,42.44 48.36,42.47 48.26,42.47 U$6.12
  Bottom 0.406: v38.35,17.63 38.35,17.73 38.51,17.73 38.53,17.75 38.53,17.86 48.36,17.86 48.39,17.83 v48.39,17.75
C_1  (via drill 0.3)
  Top 0.406: U$9.8 40.95,10.79 40.95,11.12 40.97,11.15 41.05,11.15 41.05,20.95 41.07,20.98 41.15,20.98 41.15,23.01 41.12,23.04 41.05,23.04 41.05,23.93 41.02,23.95 40.95,23.95 40.95,24.94 40.97,24.97 43.92,24.97 43.92,40.06 43.89,40.08 43.71,40.08 43.71,44.07 43.69,44.09 43.61,44.09 43.61,46.86 43.59,46.89 43.51,46.89 43.51,49.81 43.48,49.84 43.31,49.84 43.31,50.77 43.28,50.8 v43.2,50.8
  Bottom 0.406: U$6.9 v43.2,50.8
C_2  (via drill 0.3)
  Top 0.406: U$9.5 38.91,14.61 38.91,17.25 38.94,17.27 39.01,17.27 39.01,44.09 38.99,44.12 38.89,44.12 38.89,44.86 38.91,44.88 38.99,44.88 38.99,47.55 39.01,47.57 39.09,47.57 39.09,50.16 39.06,50.19 38.99,50.19 38.99,52.32 38.96,52.35 v38.89,52.35
  Bottom 0.406: v38.89,52.35 47.52,52.35 47.55,52.38 47.55,53.34 U$6.8
C_3  (via drill 0.3)
  Top 0.406: U$9.6 35.43,13.34 v35.43,15.19 | v51.59,15.27 51.49,15.37 51.49,16.97 51.38,17.07 51.38,21.13 51.18,21.34 51.18,39.06 v51.28,39.17 | v59.82,39.17 59.82,40.01 59.92,40.11 59.92,40.82 60.02,40.92 60.02,41.63 60.12,41.73 60.12,43.1 60.22,43.2 60.22,44.58 60.12,44.68 60.12,47.37 60.02,47.47 60.02,50.16 59.92,50.27 59.92,52.96 59.82,53.06 v59.82,55.88
  Bottom 0.406: v35.43,15.19 35.51,15.27 38.63,15.27 38.73,15.16 43.54,15.16 43.64,15.27 v51.59,15.27 | v51.28,39.17 51.38,39.27 59.72,39.27 v59.82,39.17 | U$6.6 v59.82,55.88
C_A  (via drill 0.3)
  Top 0.406: v47.07,45.72 47.07,41.78 47.27,41.58 47.27,21.11 v47.17,21.01 | v44.91,21.01 44.91,20.07 45.01,19.96 45.01,18.75 45.14,18.62 45.14,12.19 v45.24,12.09 | v43.81,12.09 43.81,10.57 45.49,8.89 45.49,8.79 46.02,8.26 U$9.11
  Bottom 0.406: v47.07,45.72 U$6.11 | v44.91,21.01 v47.17,21.01 | v43.81,12.09 v45.24,12.09
C_B  (via drill 0.3)
  Top 0.406: U$9.13 45.49,10.79 v45.47,10.77 | v41.6,10.77 41.6,20.62 41.71,20.73 41.71,23.27 41.6,23.37 v41.6,24.31 | v44.37,24.31 44.48,24.41 44.48,40.31 44.27,40.51 44.27,44.32 44.17,44.42 44.17,47.12 44.07,47.22 44.07,50.06 43.87,50.27 43.87,52.96 43.76,53.06 v43.76,55.88
  Bottom 0.406: v41.6,10.77 v45.47,10.77 | v44.37,24.31 v41.6,24.31 | U$6.7 v43.76,55.88
C_C  (via drill 0.3)
  Top 0.406: U$9.17 48.39,15.88 v48.39,16.43 | v50.27,16.43 50.27,20.62 50.06,20.83 50.06,40.18 v50.16,40.28 | v61.14,40.28 61.14,41.12 61.24,41.22 61.24,42.6 61.34,42.7 61.34,45.09 61.24,45.19 61.24,47.88 61.14,47.98 v61.14,50.8
  Bottom 0.406: v50.27,16.43 v48.39,16.43 | v50.16,40.28 50.27,40.39 61.04,40.39 v61.14,40.28 | U$6.4 v61.14,50.8
C_D  (via drill 0.3)
  Top 0.406: U$9.20 47.83,19.68 47.83,41.96 v47.73,42.06 | v62.46,45.72 v62.46,42.06
  Bottom 0.406: v62.46,42.06 v47.73,42.06 | U$6.2 v62.46,45.72
C_DP  (via drill 0.3)
  Top 0.406: U$9.19 46.23,18.41 46.23,18.97 46.2,19 45.57,19 v45.57,20.34 | v49.61,20.34 49.51,20.45 49.51,40.74 v49.61,40.84 | v61.8,40.84 61.8,42.34 61.9,42.44 61.9,45.34 61.8,45.44 v61.8,48.26
  Bottom 0.406: v45.57,20.34 45.67,20.24 49.51,20.24 v49.61,20.34 | v49.61,40.84 49.71,40.95 61.7,40.95 v61.8,40.84 | U$6.3 v61.8,48.26
C_E  (via drill 0.3)
  Top 0.406: U$9.18 48.06,17.14 48.11,17.09 49.05,17.09 49.05,18.03 48.95,18.14 48.95,41.3 v49.05,41.4 | U$6.1 v63.5,41.4
  Bottom 0.406: v49.05,41.4 49.15,41.5 62.08,41.5 62.18,41.4 v63.5,41.4
C_F  (via drill 0.3)
  Top 0.406: U$9.12 47.65,9.53 47.65,10.08 47.68,10.11 48.31,10.11 v48.31,11.43 | v44.48,11.43 44.58,11.53 44.58,18.36 44.45,18.49 44.45,19.71 44.35,19.81 44.35,20.62 44.25,20.73 v44.25,21.67 | v46.61,21.67 46.71,21.77 46.71,41.33 46.51,41.53 46.51,45.34 46.41,45.44 v46.41,48.26
  Bottom 0.406: v44.48,11.43 v48.31,11.43 | v46.61,21.67 v44.25,21.67 | U$6.10 v46.41,48.26
C_G  (via drill 0.3)
  Top 0.406: U$9.14 48.01,12.06 48.01,12.22 48.39,12.6 v48.39,12.68 | v51.49,13.39 51.38,13.49 51.38,14.53 50.93,14.99 50.93,16.71 50.83,16.82 50.83,20.88 50.62,21.08 50.62,39.62 v50.72,39.73 | v60.48,39.73 60.48,40.56 60.58,40.66 60.58,41.38 60.68,41.48 60.68,42.85 60.78,42.95 60.78,44.83 60.68,44.93 60.68,47.62 60.58,47.73 60.58,50.42 60.48,50.52 v60.48,53.34
  Bottom 0.406: v48.39,12.68 49.1,13.39 v51.49,13.39 | v50.72,39.73 50.83,39.83 60.38,39.83 v60.48,39.73 | U$6.5 v60.48,53.34
CANH  (via drill 0.35)
  Top 0.406: TE_AMPSEAL_8.3 81.67,46.52 R1.1 75.59,46.42 D1.1 70.58,48.09 R9.2 | v93.3,41.63 93.3,25.79 87.19,19.68 U$3.7
  Bottom 0.406: TE_AMPSEAL_8.3 87.62,45.17 89.59,43.2 92.69,43.2 93.3,42.59 v93.3,41.63
CANL
  Top 0.406: R8.2 70.58,43.48 D1.2 75.59,44.52 R1.2 79.84,44.62 81.29,43.17 TE_AMPSEAL_8.5 92.72,43.17 93.98,41.91 93.98,25.68 86.67,18.36 86.61,18.41 U$3.6
D+
  Bottom 0.406: JP12.D+ 20.32,72.15 C5.1 R17.1
D-
  Bottom 0.406: JP12.D- 19.52,72.62 C13.1 18.68,69.9 R16.1
DTR
  Bottom 0.406: R19.1 Q2.3 32.02,67.97 C10.2
FEEDBACK  (via drill 0.35)
  Top 0.406: R3.2 71.94,67.86 U$10.4
  Bottom 0.406: R3.2 R2.2
  other vias: 71.94,63.42 71.96,67.87
FTDI_DTR
  Bottom 0.406: Q2.2 28.09,70.7 R18.1 26.66,70.71 24.05,70.71 23.35,70 23.35,69.2 21.93,67.79 17.88,67.79 17.46,67.37 U1.1
GND  (via drill 0.35)
  Top 0.305: 57.12,9.35 56.77,9.35 56.38,8.96 55.14,8.96 54.98,8.79 54.61,8.79 53.34,7.52 C3.1 | 2.54,15.88 2.26,16.15 v2.13,16.15
  Top 0.406: U$7.7 2.52,12.06 | U$7.4 2.54,15.88 | U$8.4 19.05,15.88 | U$8.7 19.02,12.06 19,12.04 | U$9.4 35.56,15.88 | 35.56,15.88 35.53,15.88 35.51,15.85 | U$9.7 35.53,12.06 | 35.53,12.06 35.51,12.04 | v58.06,16.92 58.06,13.54 57.4,12.88 57.4,12.37 57.28,12.24 | 35.56,15.88 35.53,15.85 35.16,15.85 34.72,15.41 34.72,12.88 35.53,12.06 | ATMEGA328P.3 57.23,9.45 57.12,9.35
  Top 0.508: ATMEGA328P.5 58.83,9.93 58.75,9.86 | ATMEGA328P.3 57.23,12.19 57.28,12.24 | 58.12,17.93 58.01,18.03 ATMEGA328P.21 58.01,20.3 57.96,20.34
  Bottom 0.406: 73.56,75.51 73.58,75.51 | U1.16 v20,61.63 | U1.6 v20.64,65.37
  Bottom 1.27: 48.26,67.31 U$12.A 48.26,72.39 | 3.48,72.67 3.35,72.8 J1.GND J1.P$4 9.45,72.44 9.5,72.39 | U$10.6 80.01,76.2 | U$10.6 67.31,76.2 | U$10.3 73.66,70.59 | 73.66,70.59 U$10.6 | U$10.5 70.26,69.65 71.2,70.59 73.66,70.59 | 63.5,64.77 63.69,64.58 C2.- 64.96,64.77 66.04,64.77
  other vias: 2.54,76.2 3.81,76.2 5.08,76.2 73.76,45.44 68.55,35.18 63.47,30.1 58.75,25.1 51.64,6.38 2.29,12.04 58.45,73.69 58.37,72.39 59.72,72.31 59.72,73.71 57.18,73.71 57.18,72.31 22.33,73 28.85,67.92 30.23,67.92
  pour Top (isolate 0.406): 0,83.82 0,0 96.52,0 96.52,83.82
  pour Bottom (isolate 0.406): 0,83.82 0,0 96.52,0 96.52,83.82
LED2
  Top 0.406: ATMEGA328P.14 68.28,16.43 MICRO.C
MISO  (via drill 0.35)
  Top 0.406: U$7.1 v5.23,19.68 | U$8.1 v21.59,19.68 | U$9.1 v38.1,19.68 | v61.72,17.98 61.77,18.03 ATMEGA328P.16 63.65,18.03 63.88,17.8 67.59,17.8 v67.95,17.8 | U$2.15 82.98,10.16 81.72,11.43 81.72,13.72 v81.19,14.24
  Bottom 0.406: v5.23,19.68 v21.59,19.68 v38.1,19.68 59.69,19.68 60.6,18.77 | ICP.1 68.73,30.63 68.73,29.27 66.75,27.29 66.75,24.01 62.29,19.54 61.2,19.54 60.6,18.95 60.6,18.77 | v61.72,17.98 61.4,17.98 60.6,18.77 | v81.19,14.24 81.02,14.24 77.58,17.68 68.07,17.68 v67.95,17.8
MOSI  (via drill 0.35)
  Top 0.406: U$7.2 v5.21,18.41 | v61.21,17.2 61.27,17.25 ATMEGA328P.15 67.36,17.25 v67.49,17.12 | U$9.2 v38.1,18.41 | U$8.2 v21.59,18.41 | v81.03,13.43 81.03,11.32 83.46,8.89 U$2.14
  Bottom 0.406: v5.21,18.41 v21.59,18.41 v38.1,18.41 59.99,18.41 v61.21,17.2 | 61.08,17.33 v61.21,17.2 | v61.21,17.2 61.34,17.33 | ICP.4 71.4,28.22 71.4,28.09 69.14,28.09 67.87,26.82 67.87,23.55 62.4,18.08 62.4,17.7 62,17.3 61.32,17.3 v61.21,17.2 | v67.49,17.12 77.35,17.12 v81.03,13.43
N$1
  Bottom 0.406: R12.2 TX.A
N$2
  Bottom 0.406: R16.2 15.24,68.16 15.24,64.77 17.4,62.61 21.77,62.61 22.61,61.77 22.54,61.71 U1.12
N$3
  Top 0.406: R5.1 68.8,21.49 MICRO.A
N$4
  Bottom 0.406: U1.11 23.16,60.83 23.16,62 22,63.17 17.63,63.17 15.8,65 15.8,67.44 16.71,68.35 20.94,68.35 R17.2
N$5
  Top 0.406: U$3.8 82.37,22.57 R10.2
N$6
  Top 0.406: R8.1 74.88,39.66 C8.1
N$7
  Top 0.406: R9.1 72.39,51.8 C9.1
N$8
  Bottom 1.27: U$12.C 57.12,77.36 U$11.P$1 64.85,74.77 64.85,68.73 68.2,65.38 74.47,65.38 75.36,66.27 U$10.2
N$10
  Bottom 0.406: RX.A R13.2
N$12
  Top 0.406: R20.1 71.22,56.1 5V.A
N$15
  Top 0.406: U$8.15 32.8,13.34 R6.1
N$19
  Top 0.406: U$9.15 49.31,13.34 R11.1
N$22
  Top 0.406: U$7.15 16.3,13.34 R4.1
PWR_IN_12
  Bottom 1.27: TE_AMPSEAL_8.8 93.98,48.13 93.98,72.39 90.17,76.2 86.91,76.2 FUSE.P$2 FUSE.P$3 83.39,79.17 80.01,82.55 46.99,82.55 41.86,77.42 41.86,70.84 28.55,57.53 8.7,57.53 J1.VIN0
RESET  (via drill 0.35)
  Top 0.406: R7.1 76.2,27.94 73.66,25.4 71.12,25.4 ICP.5 53.72,42.8 53.72,54.89 43.28,65.33 37.54,65.33 v35.56,67.31 | ATMEGA328P.29 55.4,14.83 v55.42,14.81 | U$2.17 83.57,12.7 v83.52,12.75
  Bottom 0.406: v55.42,14.81 65.35,14.81 65.94,15.39 65.94,16.15 | 65.94,16.15 65.94,20.82 69.85,24.74 ICP.5 | v83.52,12.75 80.75,12.75 77.4,16.1 67.21,16.1 67.08,16.23 66.52,16.23 66.39,16.1 65.99,16.1 65.94,16.15 | C10.1 v35.56,67.31
RX-I  (via drill 0.35)
  Top 0.406: 53.21,14.43 53.21,14.5 53.19,14.53 | ATMEGA328P.30 53.6,14.05 53.21,14.43 | v30.35,62.71 43,62.71 v43.04,62.67 | v44.91,62.74 44.91,62.56 53.16,54.31 53.16,14.48 53.21,14.43
  Bottom 0.406: R14.1 v30.35,62.71 | v43.04,62.67 44.84,62.67 v44.91,62.74
RXCAN
  Top 0.406: U$2.2 76.35,12.7 76.81,13.16 76.81,16.66 77.29,17.14 U$3.4
RXD1
  Bottom 0.406: U1.4 19.37,65.24 20.17,64.44 26.76,64.44 R15.2
RXLED  (via drill 0.35)
  Top 0.406: v25.37,60.63 25.37,71.25 v27.71,73.58
  Bottom 0.406: v25.37,60.63 25.37,60.45 24.18,59.26 19.99,59.26 19.37,59.88 U1.17 | v27.71,73.58 28.9,73.58 RX.C
SCK  (via drill 0.35)
  Top 0.406: U$7.10 6.07,8.26 v6.08,8.27 | U$8.10 21.6,8.26 v21.61,8.27 | U$9.10 36.89,8.27 v38.15,8.27 | v60.96,13.97 60.96,16.48 60.53,16.91 60.53,17.48 61.04,17.98 61.04,19.18 ATMEGA328P.17 61.21,19.13 v61.48,18.86 61.68,18.66 63.81,18.66 63.99,18.49 v67.46,18.49 | U$2.13 84.07,8.26 83.31,8.26 80.22,11.35 v80.22,16.01
  Bottom 0.406: v61.48,18.86 62.39,18.86 67.31,23.78 67.31,27.05 68.91,28.65 69.29,28.65 ICP.3 | v6.08,8.27 v21.61,8.27 v38.15,8.27 50.78,8.27 55.5,12.98 59.97,12.98 v60.96,13.97 | v80.22,16.01 80.04,16.01 77.56,18.48 v67.47,18.48 v67.46,18.49
TX-O  (via drill 0.35)
  Top 0.406: ATMEGA328P.31 54.1,13.44 53.42,13.44 52.6,14.25 52.6,54.08 41.91,64.77 v30.48,64.77
  Bottom 0.406: v30.48,64.77 R15.1
TXCAN
  Top 0.406: U$2.1 75.31,19.86 76.43,20.98 76.45,20.95 U$3.1
TXD1
  Bottom 0.406: U1.20 17.46,60.01 18.77,58.7 24.41,58.7 27.01,61.3 R14.2
TXLED  (via drill 0.35)
  Top 0.406: v24.22,68.32 24.22,72.48 v27.94,76.2
  Bottom 0.406: U1.10 23.18,67.28 v24.22,68.32 | v27.94,76.2 TX.C
V+
  Bottom 1.27: FUSE.P$1 FUSE.P$4 78.77,66.16 | 78.77,66.16 U$10.1 | C1.+ 77.47,64.86 78.77,66.16
XTAL1
  Top 0.406: ATMEGA328P.7 60.43,10.11 58.45,8.13 58.45,6.3 57.1,4.95 U$4.3 53.74,4.95 C3.2
XTAL2
  Top 0.406: C4.1 63.1,7.75 U$4.1 61.21,8.34 ATMEGA328P.8

### Text on the board
tNames: SPEED | CURRENT | VOLTAGE | IFE 2018 / DISPLAY | v4.0